# EAGLE schematic MXChip-EMW3166-v1.0.0 (EAGLE 7.7.0)
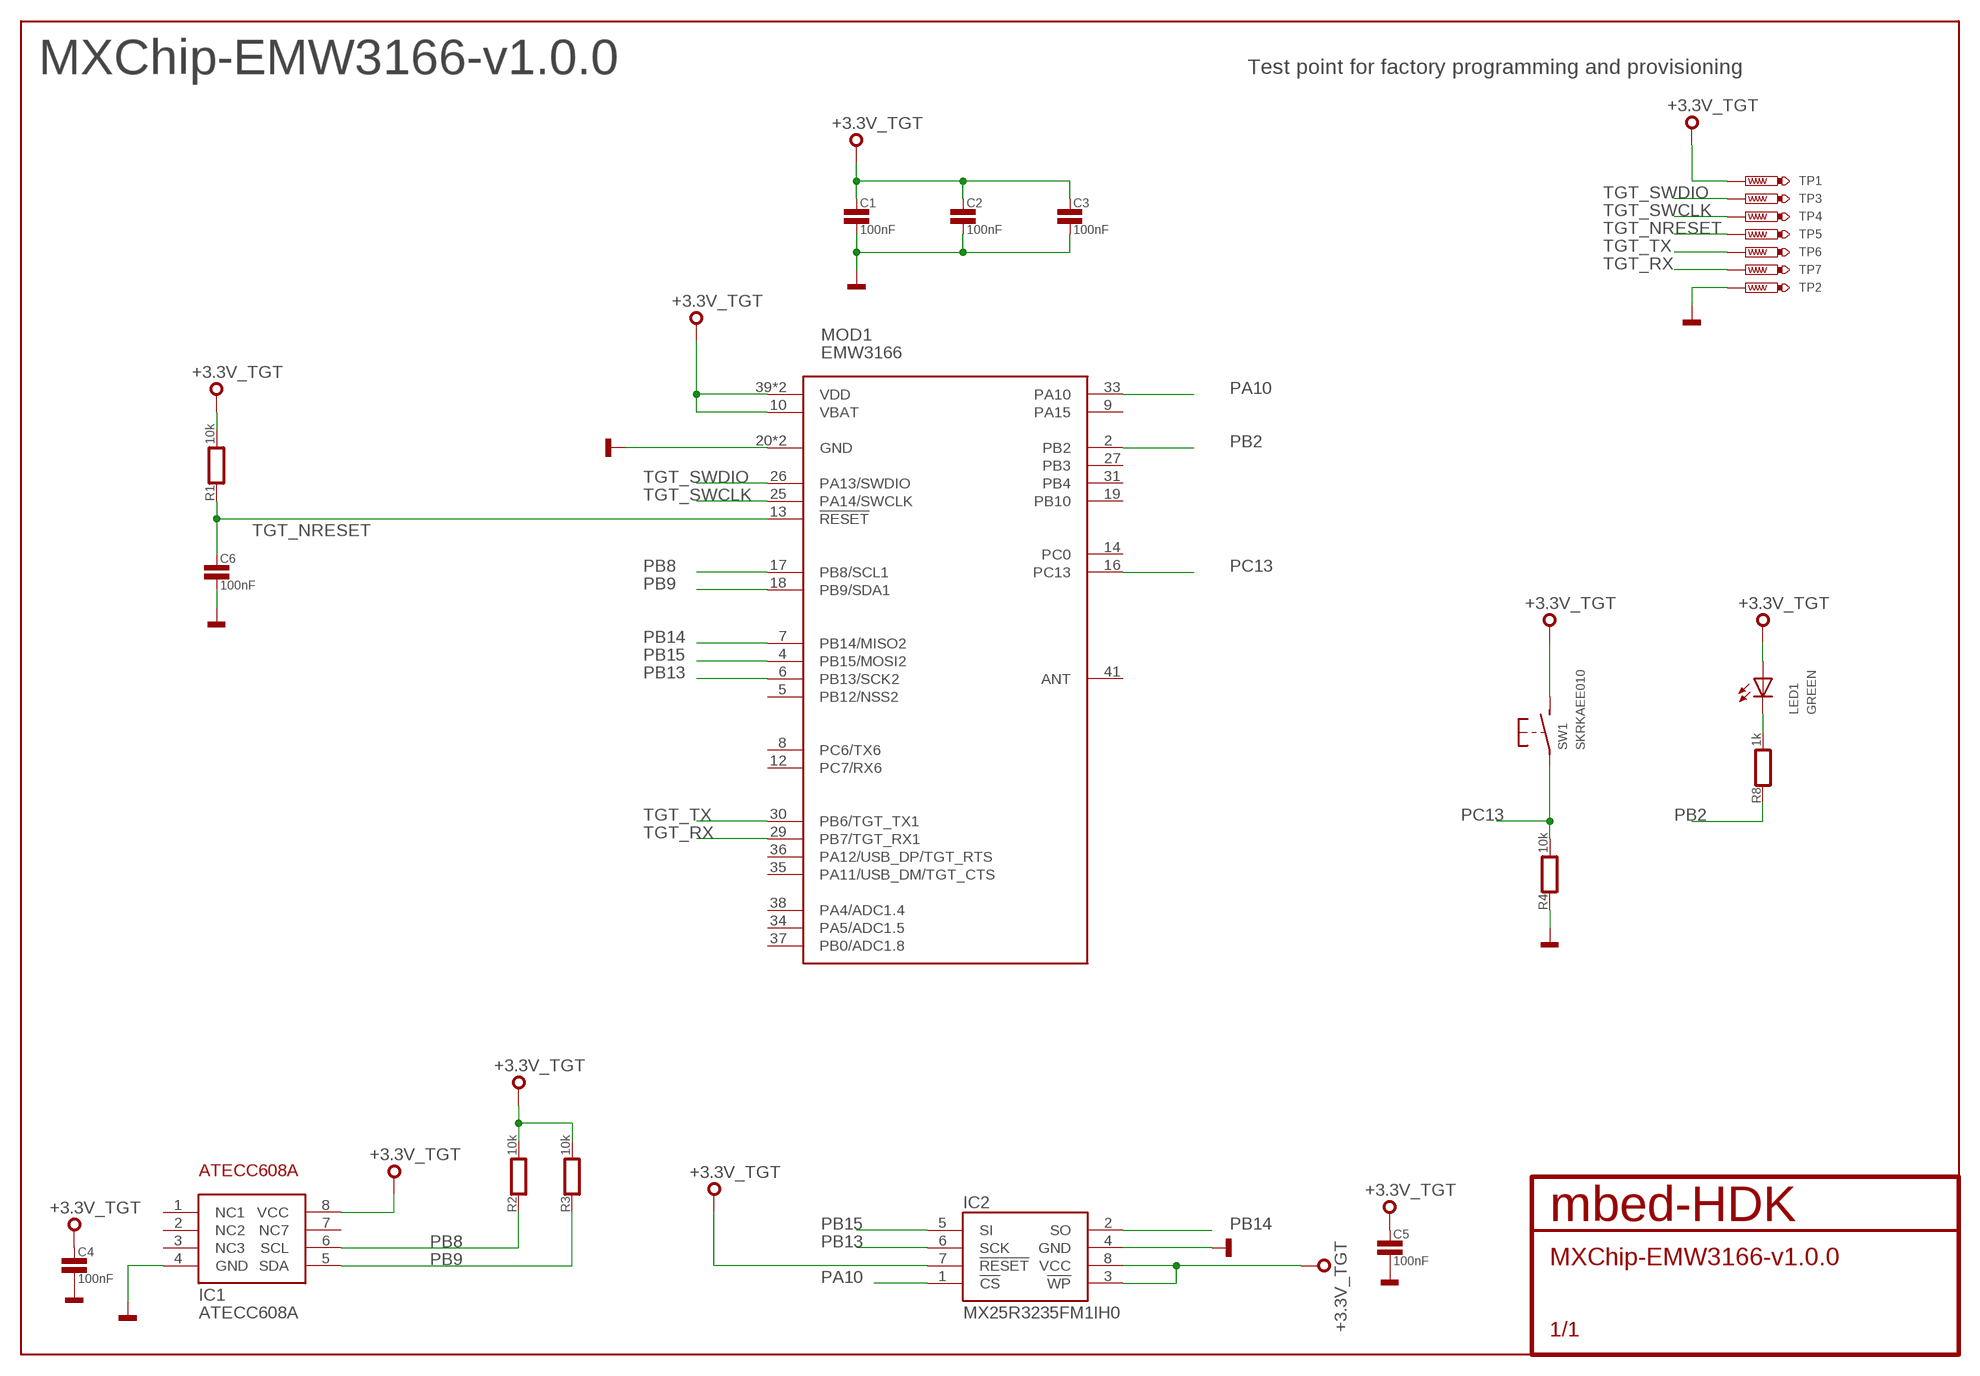
[diagram p0: schematic, sheet 1]

## Parts
C1  100nF  C0603  [0603]
C2  100nF  C0603  [0603]
C3  100nF  C0603  [0603]
C4  100nF  C0603  [0603]
C5  100nF  C0603  [0603]
C6  100nF  C0603  [0603]
IC1  ATECC608A  [SO8]
IC2  MX25R3235FM1IH0  [SO8]
LED1  GREEN  SMD_LED0603  [CHIPLED_0603]
MOD1  EMW3166  [EMW3166]
R1  10k  R0603  [0603]
R2  10k  R0603  [0603]
R3  10k  R0603  [0603]
R4  10k  R0603  [0603]
R8  1k  R0603  [0603]
SW1  SKRKAEE010  [SKRKAEE010]
TP1  TEST_POINT-50R-SMD  [TP50-SMD]
TP2  TEST_POINT-50R-SMD  [TP50-SMD]
TP3  TEST_POINT-50R-SMD  [TP50-SMD]
TP4  TEST_POINT-50R-SMD  [TP50-SMD]
TP5  TEST_POINT-50R-SMD  [TP50-SMD]
TP6  TEST_POINT-50R-SMD  [TP50-SMD]
TP7  TEST_POINT-50R-SMD  [TP50-SMD]

## Nets
+3.3V_TGT: C1.1 C2.1 C3.1 C4.1 C5.1 IC1.8(VCC) IC2.3(!WP) IC2.7(!RESET) IC2.8(VCC) LED1.A MOD1.10(VBAT) MOD1.39(VDD) MOD1.40(VDD) R1.2 R2.2 R3.2 SW1.P$2(S) TP1.TP
GND: C1.2 C2.2 C3.2 C4.2 C5.2 C6.2 IC1.4(GND) IC2.4(GND) MOD1.20(GND) MOD1.21(GND) R4.1 TP2.TP
PA10: IC2.1(!CS) MOD1.33(PA10)
PA_1: LED1.C R8.2
PB2: MOD1.2(PB2) R8.1
PB8: IC1.6(SCL) MOD1.17(PB8/SCL1) R2.1
PB9: IC1.5(SDA) MOD1.18(PB9/SDA1) R3.1
PB13: IC2.6(SCK) MOD1.6(PB13/SCK2)
PB14: IC2.2(SO) MOD1.7(PB14/MISO2)
PB15: IC2.5(SI) MOD1.4(PB15/MOSI2)
PC13: MOD1.16(PC13) R4.2 SW1.P$1(P)
TGT_NRESET: C6.1 MOD1.13(!RESET) R1.1 TP5.TP
TGT_RX: MOD1.29(PB7/TGT_RX1) TP7.TP
TGT_SWCLK: MOD1.25(PA14/SWCLK) TP4.TP
TGT_SWDIO: MOD1.26(PA13/SWDIO) TP3.TP
TGT_TX: MOD1.30(PB6/TGT_TX1) TP6.TP
Unconnected: IC1.1(NC1) IC1.2(NC2) IC1.3(NC3) IC1.7(NC7) MOD1.5(PB12/NSS2) MOD1.8(PC6/TX6) MOD1.9(PA15) MOD1.12(PC7/RX6) MOD1.14(PC0) MOD1.19(PB10) MOD1.27(PB3) MOD1.31(PB4) MOD1.34(PA5/ADC1.5) MOD1.35(PA11/USB_DM/TGT_CTS) MOD1.36(PA12/USB_DP/TGT_RTS) MOD1.37(PB0/ADC1.8) MOD1.38(PA4/ADC1.4) MOD1.41(ANT)

## Notes on the sheet
- MXChip-EMW3166-v1.0.0 | Test point for factory programming and provisioning

## Library data of the parts
C1-C6 = mbed-HDK-RLC:C: Capacitor
IC1 = mbed-HDK-MF-ATMEL:ATECC608A: I2C Secure element and crytpo accelerator; MF: Atmel; MFN: ATECC608A; OC-DIGIKEY: ATECC608A-SSHDA-TCT-ND; OC-MOUSER: 556-ATECC608ASSHDAB
IC2 = mbed-HDK-IC:MX25R3235FM1IH0: Serial Flash 32 Mb 80 Mhz; MF: Macronix; MFN: MX25R3235FM1IH0; OC-DIGIKEY: 1092-1175-ND
LED1 = mbed-HDK-Optical:SMD_LED: LED SMD, Colour Red; MF: Wurth Electronics Inc; MFN: 150060RS75000; OC-DIGIKEY: 732-4978-1-ND; OC-MOUSER: 710-150060RS75000; OC-NEWARK: 2322071
MOD1 = mbed-HDK-Modules:EMW3166
R1-R4 R8 = mbed-HDK-RLC:R: Resistor
SW1 = mbed-HDK-Switch:SKRKAEE010: MOMENTARY SWITCH PUSH VERTICAL (SPST); MF: ALPS; MFN: SKRKAEE010; OC-MOUSER: 688-SKRKAE
TP1-TP7 = mbed-HDK-Connector:TEST_POINT